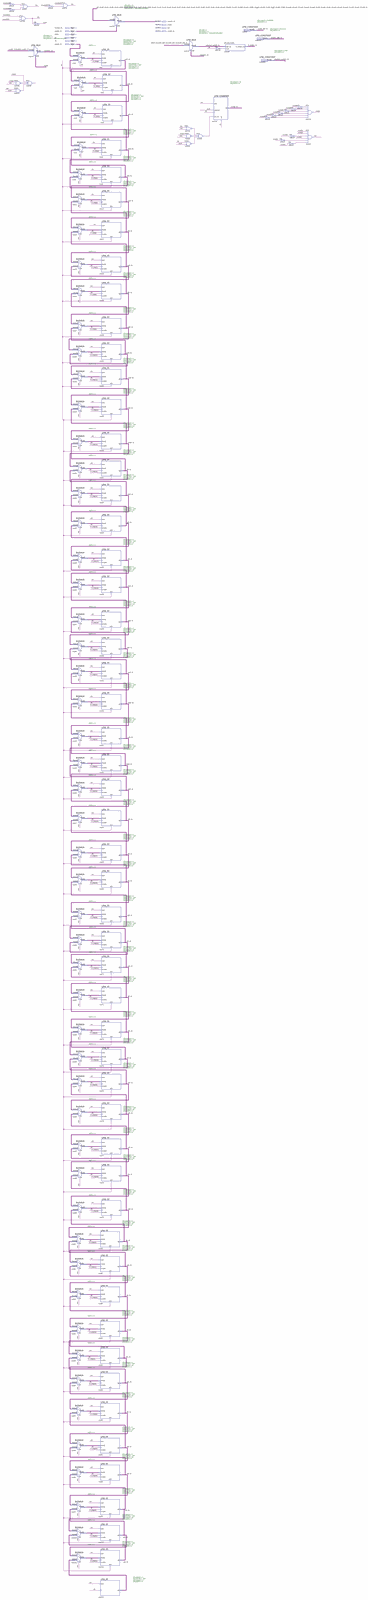
[diagram p0: schematic sheet, whole]
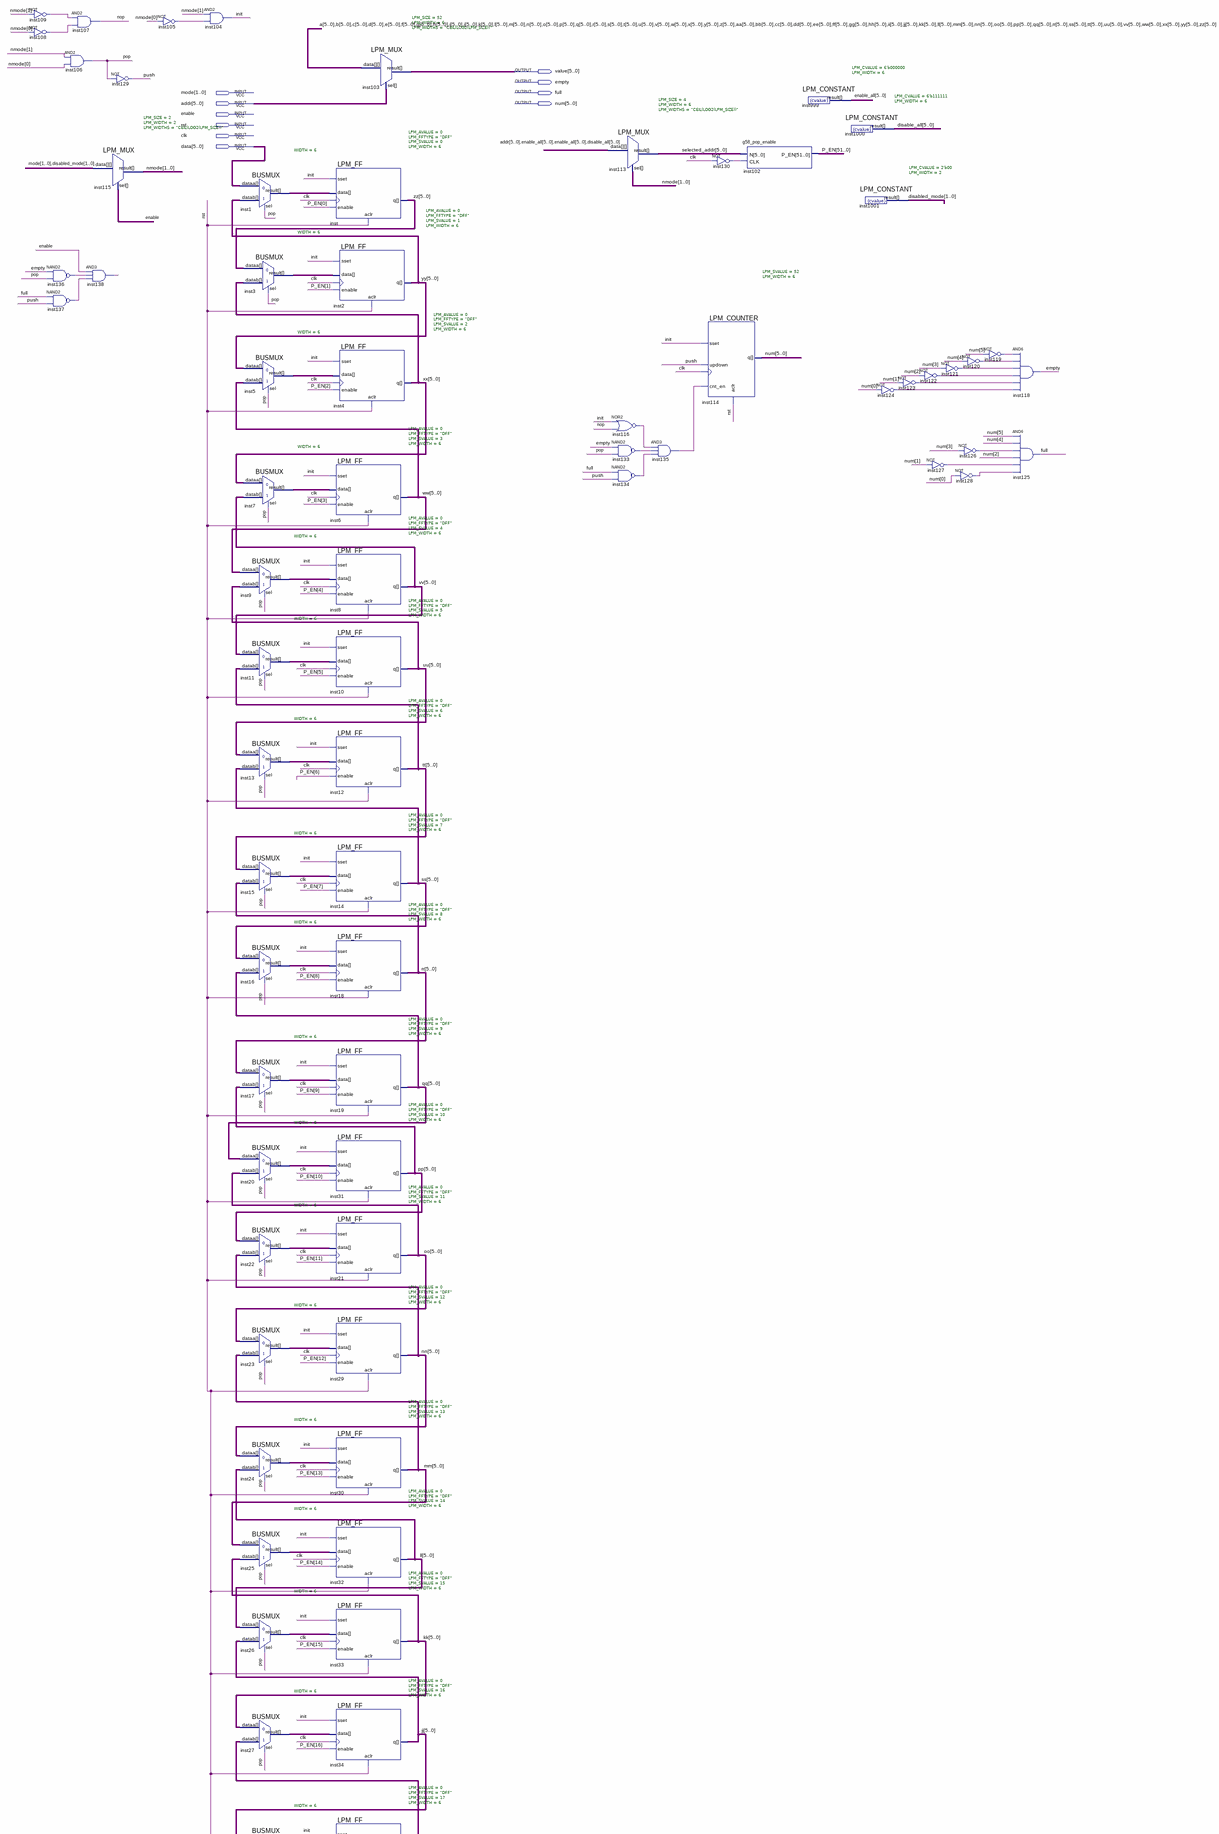
[diagram p1: schematic sheet, upper part]
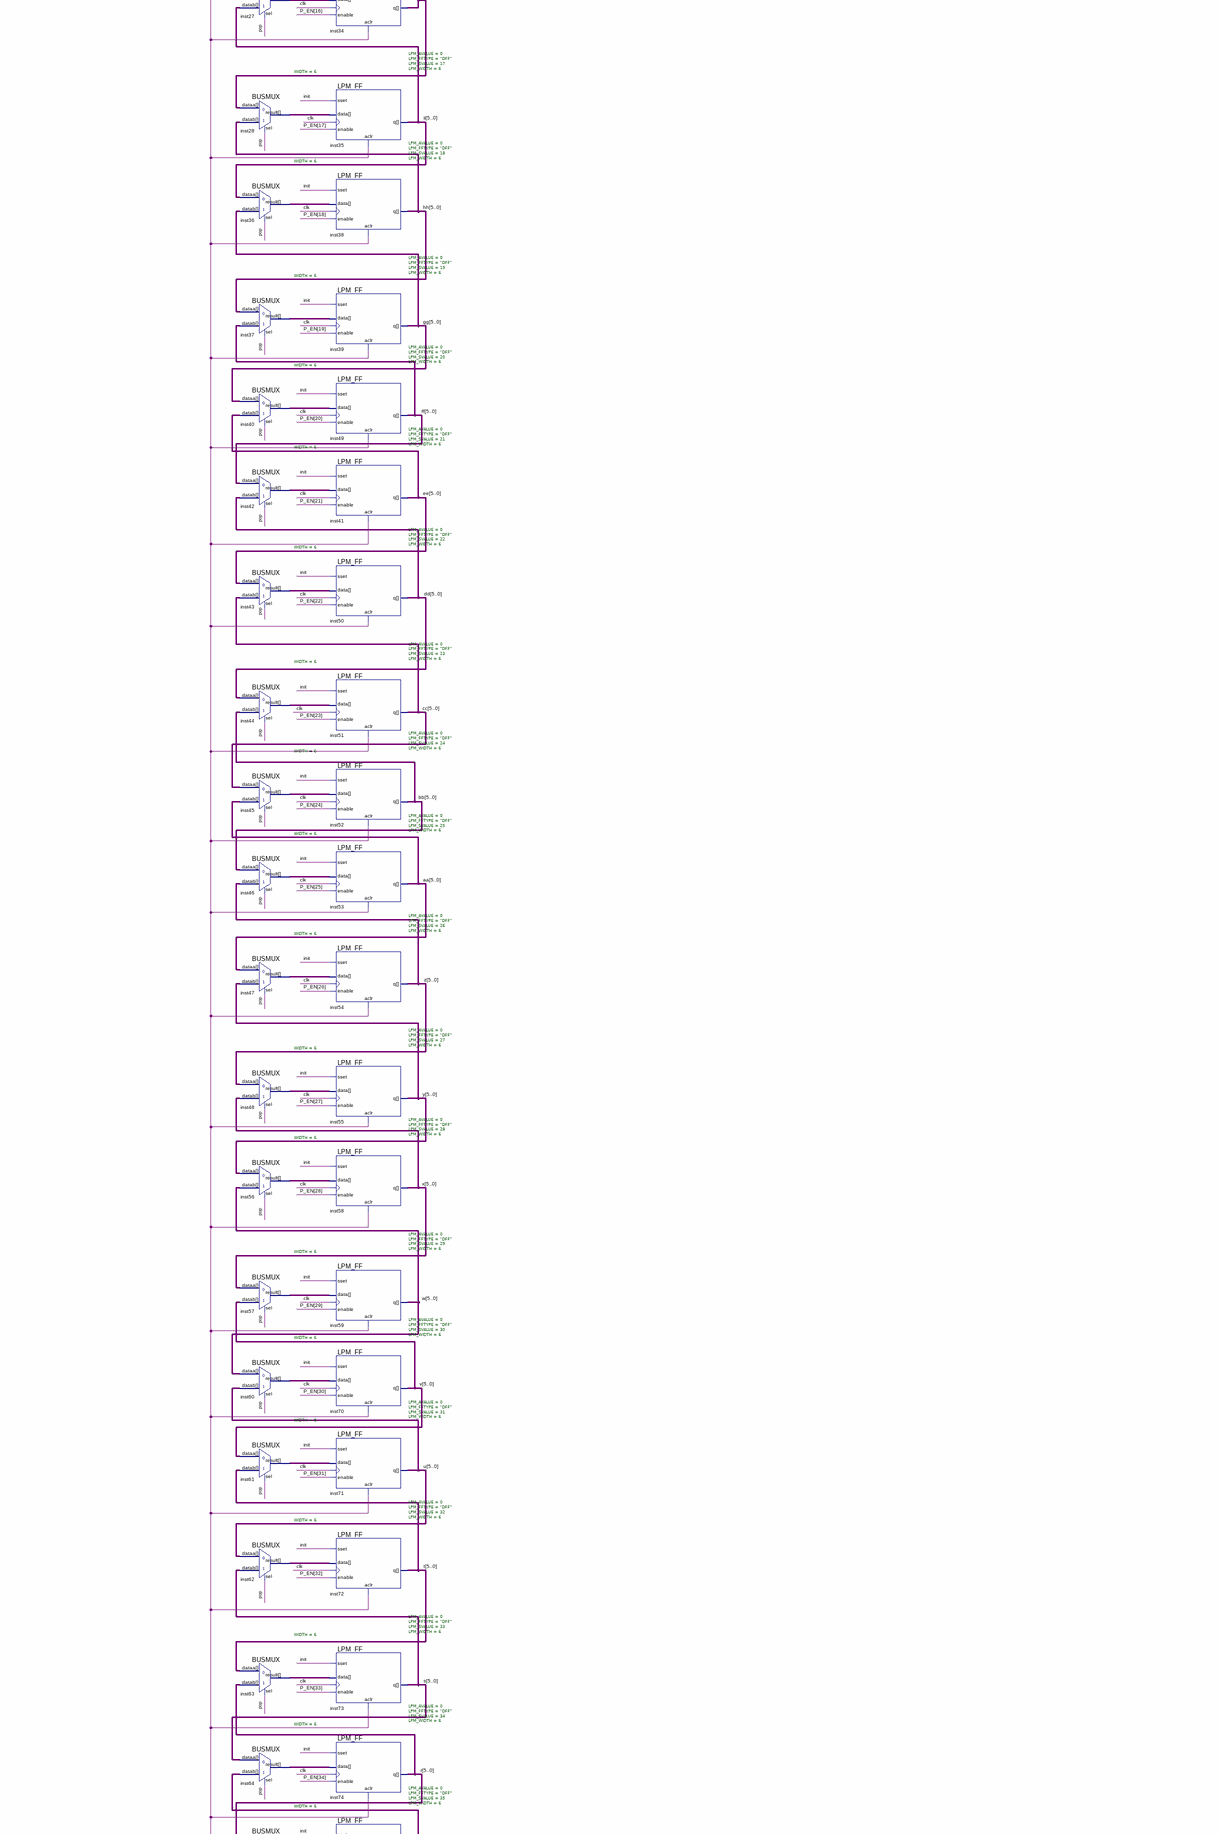
[diagram p2: schematic sheet, middle part]
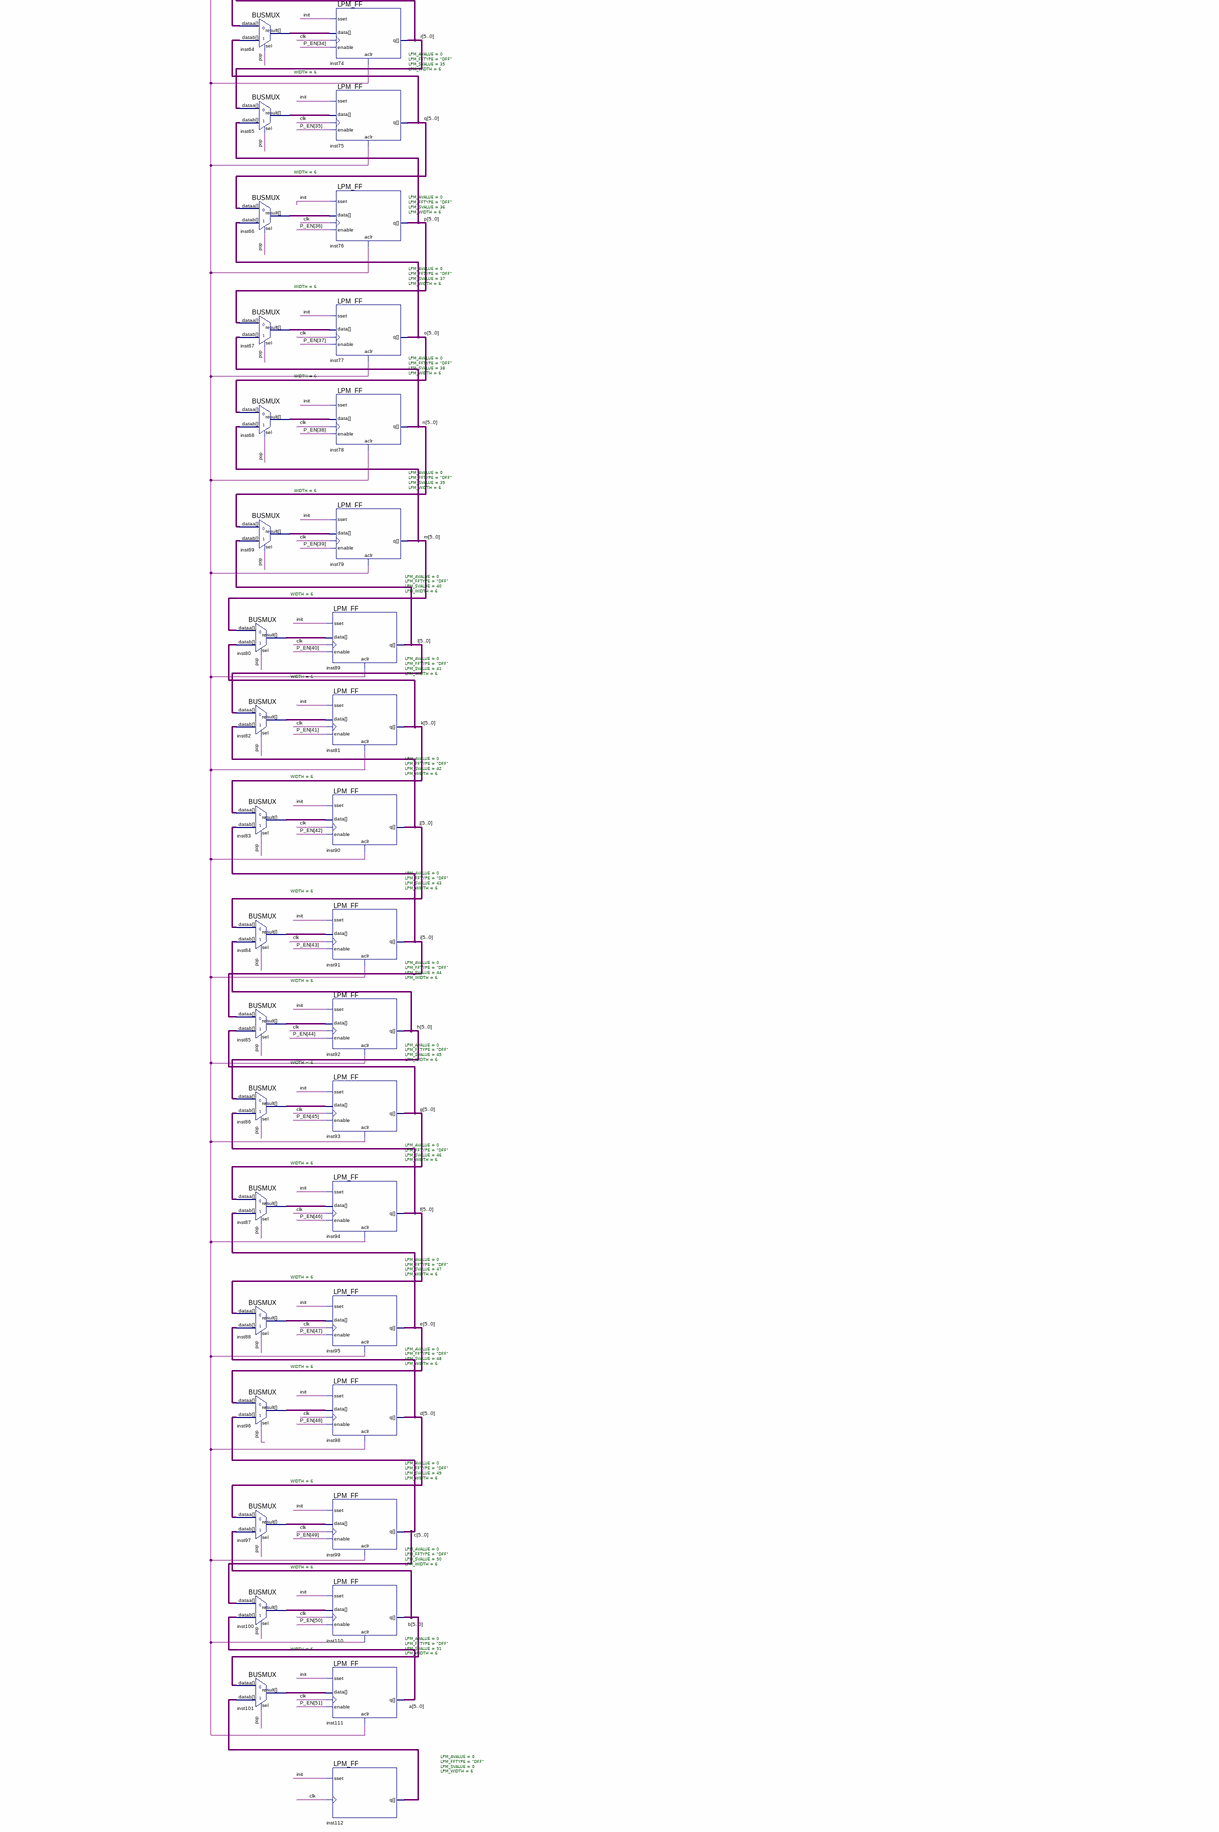
[diagram p3: schematic sheet, lower part]
// Quartus schematic g58_stack52.bdf as structural Verilog: 139 symbols, 10 pins
module g58_stack52 (
  input  [1:0] mode,
  input  [5:0] addr,
  input  enable,
  input  rst,
  input  clk,
  input  [5:0] data,
  output [5:0] value,
  output empty,
  output full,
  output [5:0] num
);

  wire init, inst105_out, inst108_out, inst109_out, inst116_out, inst119_out, inst120_out, inst121_out,
       inst122_out, inst123_out, inst124_out, inst126_out, inst127_out, inst128_out, inst130_out,
       inst133_out, inst134_out, inst135_out, inst136_out, inst137_out, inst138_out, nop, pop, push;
  wire [1:0] disabled_mode, nmode;
  wire [5:0] a, aa, b, bb, c, cc, d, dd, disable_all, e, ee, enable_all, f, ff, g, gg, h, hh, i, ii,
       inst1_result, inst3_result, inst5_result, inst7_result, inst9_result, inst11_result, inst13_result,
       inst15_result, inst16_result, inst17_result, inst20_result, inst22_result, inst23_result,
       inst24_result, inst25_result, inst26_result, inst27_result, inst28_result, inst36_result,
       inst37_result, inst40_result, inst42_result, inst43_result, inst44_result, inst45_result,
       inst46_result, inst47_result, inst48_result, inst56_result, inst57_result, inst60_result,
       inst61_result, inst62_result, inst63_result, inst64_result, inst65_result, inst66_result,
       inst67_result, inst68_result, inst69_result, inst80_result, inst82_result, inst83_result,
       inst84_result, inst85_result, inst86_result, inst87_result, inst88_result, inst96_result,
       inst97_result, inst100_result, inst101_result, inst112_q, j, jj, k, kk, l, ll, m, mm, n, nn, o, oo, p,
       pp, q, qq, r, rr, s, selected_addr, ss, t, tt, u, uu, v, vv, w, ww, x, xx, y, yy, z, zz;
  wire [51:0] P_EN;

  not inst109 (inst109_out, nmode[1]);
  not inst108 (inst108_out, nmode[0]);
  and inst106 (pop, nmode[1], nmode[0]);
  nand inst136 (inst136_out, empty, pop);
  nand inst137 (inst137_out, full, push);
  and inst107 (nop, inst109_out, inst108_out);
  LPM_MUX #(.LPM_SIZE(2), .LPM_WIDTH(2), .LPM_WIDTHS("CEIL(LOG2(LPM_SIZE))")) inst115 (
    .data({mode, disabled_mode}), .sel(enable), .result(nmode));
  and inst138 (inst138_out, enable, inst136_out, inst137_out);
  not inst129 (push, pop);
  not inst105 (inst105_out, nmode[0]);
  and inst104 (init, nmode[1], inst105_out);
  BUSMUX #(.WIDTH(6)) inst1 (.datab(yy), .sel(pop), .dataa(data), .result(inst1_result));
  BUSMUX #(.WIDTH(6)) inst9 (.datab(uu), .sel(pop), .dataa(ww), .result(inst9_result));
  BUSMUX #(.WIDTH(6)) inst11 (.datab(tt), .sel(pop), .dataa(vv), .result(inst11_result));
  BUSMUX #(.WIDTH(6)) inst13 (.datab(ss), .sel(pop), .dataa(uu), .result(inst13_result));
  BUSMUX #(.WIDTH(6)) inst15 (.datab(rr), .sel(pop), .dataa(tt), .result(inst15_result));
  BUSMUX #(.WIDTH(6)) inst16 (.datab(qq), .sel(pop), .dataa(ss), .result(inst16_result));
  BUSMUX #(.WIDTH(6)) inst17 (.datab(pp), .sel(pop), .dataa(rr), .result(inst17_result));
  BUSMUX #(.WIDTH(6)) inst20 (.datab(oo), .sel(pop), .dataa(qq), .result(inst20_result));
  BUSMUX #(.WIDTH(6)) inst22 (.datab(nn), .sel(pop), .dataa(pp), .result(inst22_result));
  BUSMUX #(.WIDTH(6)) inst23 (.datab(mm), .sel(pop), .dataa(oo), .result(inst23_result));
  BUSMUX #(.WIDTH(6)) inst24 (.datab(ll), .sel(pop), .dataa(nn), .result(inst24_result));
  BUSMUX #(.WIDTH(6)) inst25 (.datab(kk), .sel(pop), .dataa(mm), .result(inst25_result));
  BUSMUX #(.WIDTH(6)) inst26 (.datab(jj), .sel(pop), .dataa(ll), .result(inst26_result));
  BUSMUX #(.WIDTH(6)) inst27 (.datab(ii), .sel(pop), .dataa(kk), .result(inst27_result));
  BUSMUX #(.WIDTH(6)) inst28 (.datab(hh), .sel(pop), .dataa(jj), .result(inst28_result));
  BUSMUX #(.WIDTH(6)) inst36 (.datab(gg), .sel(pop), .dataa(ii), .result(inst36_result));
  BUSMUX #(.WIDTH(6)) inst37 (.datab(ff), .sel(pop), .dataa(hh), .result(inst37_result));
  BUSMUX #(.WIDTH(6)) inst40 (.datab(ee), .sel(pop), .dataa(gg), .result(inst40_result));
  BUSMUX #(.WIDTH(6)) inst42 (.datab(dd), .sel(pop), .dataa(ff), .result(inst42_result));
  BUSMUX #(.WIDTH(6)) inst43 (.datab(cc), .sel(pop), .dataa(ee), .result(inst43_result));
  BUSMUX #(.WIDTH(6)) inst44 (.datab(bb), .sel(pop), .dataa(dd), .result(inst44_result));
  BUSMUX #(.WIDTH(6)) inst45 (.datab(aa), .sel(pop), .dataa(cc), .result(inst45_result));
  BUSMUX #(.WIDTH(6)) inst46 (.datab(z), .sel(pop), .dataa(bb), .result(inst46_result));
  BUSMUX #(.WIDTH(6)) inst47 (.datab(y), .sel(pop), .dataa(aa), .result(inst47_result));
  BUSMUX #(.WIDTH(6)) inst48 (.datab(x), .sel(pop), .dataa(z), .result(inst48_result));
  BUSMUX #(.WIDTH(6)) inst56 (.datab(w), .sel(pop), .dataa(y), .result(inst56_result));
  BUSMUX #(.WIDTH(6)) inst57 (.datab(v), .sel(pop), .dataa(x), .result(inst57_result));
  BUSMUX #(.WIDTH(6)) inst60 (.datab(u), .sel(pop), .dataa(w), .result(inst60_result));
  BUSMUX #(.WIDTH(6)) inst61 (.datab(t), .sel(pop), .dataa(v), .result(inst61_result));
  BUSMUX #(.WIDTH(6)) inst62 (.datab(s), .sel(pop), .dataa(u), .result(inst62_result));
  BUSMUX #(.WIDTH(6)) inst63 (.datab(r), .sel(pop), .dataa(t), .result(inst63_result));
  BUSMUX #(.WIDTH(6)) inst64 (.datab(q), .sel(pop), .dataa(s), .result(inst64_result));
  BUSMUX #(.WIDTH(6)) inst65 (.datab(p), .sel(pop), .dataa(r), .result(inst65_result));
  BUSMUX #(.WIDTH(6)) inst66 (.datab(o), .sel(pop), .dataa(q), .result(inst66_result));
  BUSMUX #(.WIDTH(6)) inst67 (.datab(n), .sel(pop), .dataa(p), .result(inst67_result));
  BUSMUX #(.WIDTH(6)) inst68 (.datab(m), .sel(pop), .dataa(o), .result(inst68_result));
  BUSMUX #(.WIDTH(6)) inst69 (.datab(l), .sel(pop), .dataa(n), .result(inst69_result));
  BUSMUX #(.WIDTH(6)) inst80 (.datab(k), .sel(pop), .dataa(m), .result(inst80_result));
  BUSMUX #(.WIDTH(6)) inst82 (.datab(j), .sel(pop), .dataa(l), .result(inst82_result));
  BUSMUX #(.WIDTH(6)) inst83 (.datab(i), .sel(pop), .dataa(k), .result(inst83_result));
  BUSMUX #(.WIDTH(6)) inst84 (.datab(h), .sel(pop), .dataa(j), .result(inst84_result));
  BUSMUX #(.WIDTH(6)) inst85 (.datab(g), .sel(pop), .dataa(i), .result(inst85_result));
  BUSMUX #(.WIDTH(6)) inst86 (.datab(f), .sel(pop), .dataa(h), .result(inst86_result));
  BUSMUX #(.WIDTH(6)) inst87 (.datab(e), .sel(pop), .dataa(g), .result(inst87_result));
  BUSMUX #(.WIDTH(6)) inst88 (.datab(d), .sel(pop), .dataa(f), .result(inst88_result));
  BUSMUX #(.WIDTH(6)) inst96 (.datab(c), .sel(pop), .dataa(e), .result(inst96_result));
  BUSMUX #(.WIDTH(6)) inst97 (.datab(b), .sel(pop), .dataa(d), .result(inst97_result));
  BUSMUX #(.WIDTH(6)) inst100 (.datab(a), .sel(pop), .dataa(c), .result(inst100_result));
  BUSMUX #(.WIDTH(6)) inst101 (.datab(inst112_q), .sel(pop), .dataa(b), .result(inst101_result));
  BUSMUX #(.WIDTH(6)) inst3 (.datab(xx), .sel(pop), .dataa(zz), .result(inst3_result));
  BUSMUX #(.WIDTH(6)) inst5 (.datab(ww), .sel(pop), .dataa(yy), .result(inst5_result));
  BUSMUX #(.WIDTH(6)) inst7 (.datab(vv), .sel(pop), .dataa(xx), .result(inst7_result));
  LPM_FF #(.LPM_AVALUE(0), .LPM_FFTYPE("DFF"), .LPM_SVALUE(40), .LPM_WIDTH(6)) inst89 (
    .aclr(rst), .clock(clk), .data(inst80_result), .enable(P_EN[40]), .sset(init), .q(l));
  LPM_FF #(.LPM_AVALUE(0), .LPM_FFTYPE("DFF"), .LPM_SVALUE(41), .LPM_WIDTH(6)) inst81 (
    .aclr(rst), .clock(clk), .data(inst82_result), .enable(P_EN[41]), .sset(init), .q(k));
  LPM_FF #(.LPM_AVALUE(0), .LPM_FFTYPE("DFF"), .LPM_SVALUE(42), .LPM_WIDTH(6)) inst90 (
    .aclr(rst), .clock(clk), .data(inst83_result), .enable(P_EN[42]), .sset(init), .q(j));
  LPM_FF #(.LPM_AVALUE(0), .LPM_FFTYPE("DFF"), .LPM_SVALUE(43), .LPM_WIDTH(6)) inst91 (
    .aclr(rst), .clock(clk), .data(inst84_result), .enable(P_EN[43]), .sset(init), .q(i));
  LPM_FF #(.LPM_AVALUE(0), .LPM_FFTYPE("DFF"), .LPM_SVALUE(44), .LPM_WIDTH(6)) inst92 (
    .aclr(rst), .clock(clk), .data(inst85_result), .enable(P_EN[44]), .sset(init), .q(h));
  LPM_FF #(.LPM_AVALUE(0), .LPM_FFTYPE("DFF"), .LPM_SVALUE(45), .LPM_WIDTH(6)) inst93 (
    .aclr(rst), .clock(clk), .data(inst86_result), .enable(P_EN[45]), .sset(init), .q(g));
  LPM_FF #(.LPM_AVALUE(0), .LPM_FFTYPE("DFF"), .LPM_SVALUE(46), .LPM_WIDTH(6)) inst94 (
    .aclr(rst), .clock(clk), .data(inst87_result), .enable(P_EN[46]), .sset(init), .q(f));
  LPM_FF #(.LPM_AVALUE(0), .LPM_FFTYPE("DFF"), .LPM_SVALUE(47), .LPM_WIDTH(6)) inst95 (
    .aclr(rst), .clock(clk), .data(inst88_result), .enable(P_EN[47]), .sset(init), .q(e));
  LPM_FF #(.LPM_AVALUE(0), .LPM_FFTYPE("DFF"), .LPM_SVALUE(48), .LPM_WIDTH(6)) inst98 (
    .aclr(rst), .clock(clk), .data(inst96_result), .enable(P_EN[48]), .sset(init), .q(d));
  LPM_FF #(.LPM_AVALUE(0), .LPM_FFTYPE("DFF"), .LPM_SVALUE(49), .LPM_WIDTH(6)) inst99 (
    .aclr(rst), .clock(clk), .data(inst97_result), .enable(P_EN[49]), .sset(init), .q(c));
  LPM_FF #(.LPM_AVALUE(0), .LPM_FFTYPE("DFF"), .LPM_SVALUE(50), .LPM_WIDTH(6)) inst110 (
    .aclr(rst), .clock(clk), .data(inst100_result), .enable(P_EN[50]), .sset(init), .q(b));
  LPM_FF #(.LPM_AVALUE(0), .LPM_FFTYPE("DFF"), .LPM_SVALUE(51), .LPM_WIDTH(6)) inst111 (
    .aclr(rst), .clock(clk), .data(inst101_result), .enable(P_EN[51]), .sset(init), .q(a));
  LPM_FF #(.LPM_AVALUE(0), .LPM_FFTYPE("DFF"), .LPM_SVALUE(0), .LPM_WIDTH(6)) inst112 (
    .clock(clk), .sset(init), .q(inst112_q));
  LPM_FF #(.LPM_AVALUE(0), .LPM_FFTYPE("DFF"), .LPM_SVALUE(0), .LPM_WIDTH(6)) inst (
    .aclr(rst), .clock(clk), .data(inst1_result), .enable(P_EN[0]), .sset(init), .q(zz));
  LPM_FF #(.LPM_AVALUE(0), .LPM_FFTYPE("DFF"), .LPM_SVALUE(1), .LPM_WIDTH(6)) inst2 (
    .aclr(rst), .clock(clk), .data(inst3_result), .enable(P_EN[1]), .sset(init), .q(yy));
  LPM_FF #(.LPM_AVALUE(0), .LPM_FFTYPE("DFF"), .LPM_SVALUE(2), .LPM_WIDTH(6)) inst4 (
    .aclr(rst), .clock(clk), .data(inst5_result), .enable(P_EN[2]), .sset(init), .q(xx));
  LPM_FF #(.LPM_AVALUE(0), .LPM_FFTYPE("DFF"), .LPM_SVALUE(3), .LPM_WIDTH(6)) inst6 (
    .aclr(rst), .clock(clk), .data(inst7_result), .enable(P_EN[3]), .sset(init), .q(ww));
  LPM_FF #(.LPM_AVALUE(0), .LPM_FFTYPE("DFF"), .LPM_SVALUE(4), .LPM_WIDTH(6)) inst8 (
    .aclr(rst), .clock(clk), .data(inst9_result), .enable(P_EN[4]), .sset(init), .q(vv));
  LPM_FF #(.LPM_AVALUE(0), .LPM_FFTYPE("DFF"), .LPM_SVALUE(5), .LPM_WIDTH(6)) inst10 (
    .aclr(rst), .clock(clk), .data(inst11_result), .enable(P_EN[5]), .sset(init), .q(uu));
  LPM_FF #(.LPM_AVALUE(0), .LPM_FFTYPE("DFF"), .LPM_SVALUE(6), .LPM_WIDTH(6)) inst12 (
    .aclr(rst), .clock(clk), .data(inst13_result), .enable(P_EN[6]), .sset(init), .q(tt));
  LPM_FF #(.LPM_AVALUE(0), .LPM_FFTYPE("DFF"), .LPM_SVALUE(7), .LPM_WIDTH(6)) inst14 (
    .aclr(rst), .clock(clk), .data(inst15_result), .enable(P_EN[7]), .sset(init), .q(ss));
  LPM_FF #(.LPM_AVALUE(0), .LPM_FFTYPE("DFF"), .LPM_SVALUE(8), .LPM_WIDTH(6)) inst18 (
    .aclr(rst), .clock(clk), .data(inst16_result), .enable(P_EN[8]), .sset(init), .q(rr));
  LPM_FF #(.LPM_AVALUE(0), .LPM_FFTYPE("DFF"), .LPM_SVALUE(9), .LPM_WIDTH(6)) inst19 (
    .aclr(rst), .clock(clk), .data(inst17_result), .enable(P_EN[9]), .sset(init), .q(qq));
  LPM_FF #(.LPM_AVALUE(0), .LPM_FFTYPE("DFF"), .LPM_SVALUE(10), .LPM_WIDTH(6)) inst31 (
    .aclr(rst), .clock(clk), .data(inst20_result), .enable(P_EN[10]), .sset(init), .q(pp));
  LPM_FF #(.LPM_AVALUE(0), .LPM_FFTYPE("DFF"), .LPM_SVALUE(11), .LPM_WIDTH(6)) inst21 (
    .aclr(rst), .clock(clk), .data(inst22_result), .enable(P_EN[11]), .sset(init), .q(oo));
  LPM_FF #(.LPM_AVALUE(0), .LPM_FFTYPE("DFF"), .LPM_SVALUE(12), .LPM_WIDTH(6)) inst29 (
    .aclr(rst), .clock(clk), .data(inst23_result), .enable(P_EN[12]), .sset(init), .q(nn));
  LPM_FF #(.LPM_AVALUE(0), .LPM_FFTYPE("DFF"), .LPM_SVALUE(13), .LPM_WIDTH(6)) inst30 (
    .aclr(rst), .clock(clk), .data(inst24_result), .enable(P_EN[13]), .sset(init), .q(mm));
  LPM_FF #(.LPM_AVALUE(0), .LPM_FFTYPE("DFF"), .LPM_SVALUE(14), .LPM_WIDTH(6)) inst32 (
    .aclr(rst), .clock(clk), .data(inst25_result), .enable(P_EN[14]), .sset(init), .q(ll));
  LPM_FF #(.LPM_AVALUE(0), .LPM_FFTYPE("DFF"), .LPM_SVALUE(15), .LPM_WIDTH(6)) inst33 (
    .aclr(rst), .clock(clk), .data(inst26_result), .enable(P_EN[15]), .sset(init), .q(kk));
  LPM_FF #(.LPM_AVALUE(0), .LPM_FFTYPE("DFF"), .LPM_SVALUE(16), .LPM_WIDTH(6)) inst34 (
    .aclr(rst), .clock(clk), .data(inst27_result), .enable(P_EN[16]), .sset(init), .q(jj));
  LPM_FF #(.LPM_AVALUE(0), .LPM_FFTYPE("DFF"), .LPM_SVALUE(17), .LPM_WIDTH(6)) inst35 (
    .aclr(rst), .clock(clk), .data(inst28_result), .enable(P_EN[17]), .sset(init), .q(ii));
  LPM_FF #(.LPM_AVALUE(0), .LPM_FFTYPE("DFF"), .LPM_SVALUE(18), .LPM_WIDTH(6)) inst38 (
    .aclr(rst), .clock(clk), .data(inst36_result), .enable(P_EN[18]), .sset(init), .q(hh));
  LPM_FF #(.LPM_AVALUE(0), .LPM_FFTYPE("DFF"), .LPM_SVALUE(19), .LPM_WIDTH(6)) inst39 (
    .aclr(rst), .clock(clk), .data(inst37_result), .enable(P_EN[19]), .sset(init), .q(gg));
  LPM_FF #(.LPM_AVALUE(0), .LPM_FFTYPE("DFF"), .LPM_SVALUE(20), .LPM_WIDTH(6)) inst49 (
    .aclr(rst), .clock(clk), .data(inst40_result), .enable(P_EN[20]), .sset(init), .q(ff));
  LPM_FF #(.LPM_AVALUE(0), .LPM_FFTYPE("DFF"), .LPM_SVALUE(21), .LPM_WIDTH(6)) inst41 (
    .aclr(rst), .clock(clk), .data(inst42_result), .enable(P_EN[21]), .sset(init), .q(ee));
  LPM_FF #(.LPM_AVALUE(0), .LPM_FFTYPE("DFF"), .LPM_SVALUE(22), .LPM_WIDTH(6)) inst50 (
    .aclr(rst), .clock(clk), .data(inst43_result), .enable(P_EN[22]), .sset(init), .q(dd));
  LPM_FF #(.LPM_AVALUE(0), .LPM_FFTYPE("DFF"), .LPM_SVALUE(23), .LPM_WIDTH(6)) inst51 (
    .aclr(rst), .clock(clk), .data(inst44_result), .enable(P_EN[23]), .sset(init), .q(cc));
  LPM_FF #(.LPM_AVALUE(0), .LPM_FFTYPE("DFF"), .LPM_SVALUE(24), .LPM_WIDTH(6)) inst52 (
    .aclr(rst), .clock(clk), .data(inst45_result), .enable(P_EN[24]), .sset(init), .q(bb));
  LPM_FF #(.LPM_AVALUE(0), .LPM_FFTYPE("DFF"), .LPM_SVALUE(25), .LPM_WIDTH(6)) inst53 (
    .aclr(rst), .clock(clk), .data(inst46_result), .enable(P_EN[25]), .sset(init), .q(aa));
  LPM_FF #(.LPM_AVALUE(0), .LPM_FFTYPE("DFF"), .LPM_SVALUE(26), .LPM_WIDTH(6)) inst54 (
    .aclr(rst), .clock(clk), .data(inst47_result), .enable(P_EN[26]), .sset(init), .q(z));
  LPM_FF #(.LPM_AVALUE(0), .LPM_FFTYPE("DFF"), .LPM_SVALUE(27), .LPM_WIDTH(6)) inst55 (
    .aclr(rst), .clock(clk), .data(inst48_result), .enable(P_EN[27]), .sset(init), .q(y));
  LPM_FF #(.LPM_AVALUE(0), .LPM_FFTYPE("DFF"), .LPM_SVALUE(28), .LPM_WIDTH(6)) inst58 (
    .aclr(rst), .clock(clk), .data(inst56_result), .enable(P_EN[28]), .sset(init), .q(x));
  LPM_FF #(.LPM_AVALUE(0), .LPM_FFTYPE("DFF"), .LPM_SVALUE(29), .LPM_WIDTH(6)) inst59 (
    .aclr(rst), .clock(clk), .data(inst57_result), .enable(P_EN[29]), .sset(init), .q(w));
  LPM_FF #(.LPM_AVALUE(0), .LPM_FFTYPE("DFF"), .LPM_SVALUE(30), .LPM_WIDTH(6)) inst70 (
    .aclr(rst), .clock(clk), .data(inst60_result), .enable(P_EN[30]), .sset(init), .q(v));
  LPM_FF #(.LPM_AVALUE(0), .LPM_FFTYPE("DFF"), .LPM_SVALUE(31), .LPM_WIDTH(6)) inst71 (
    .aclr(rst), .clock(clk), .data(inst61_result), .enable(P_EN[31]), .sset(init), .q(u));
  LPM_FF #(.LPM_AVALUE(0), .LPM_FFTYPE("DFF"), .LPM_SVALUE(32), .LPM_WIDTH(6)) inst72 (
    .aclr(rst), .clock(clk), .data(inst62_result), .enable(P_EN[32]), .sset(init), .q(t));
  LPM_FF #(.LPM_AVALUE(0), .LPM_FFTYPE("DFF"), .LPM_SVALUE(33), .LPM_WIDTH(6)) inst73 (
    .aclr(rst), .clock(clk), .data(inst63_result), .enable(P_EN[33]), .sset(init), .q(s));
  LPM_FF #(.LPM_AVALUE(0), .LPM_FFTYPE("DFF"), .LPM_SVALUE(34), .LPM_WIDTH(6)) inst74 (
    .aclr(rst), .clock(clk), .data(inst64_result), .enable(P_EN[34]), .sset(init), .q(r));
  LPM_FF #(.LPM_AVALUE(0), .LPM_FFTYPE("DFF"), .LPM_SVALUE(35), .LPM_WIDTH(6)) inst75 (
    .aclr(rst), .clock(clk), .data(inst65_result), .enable(P_EN[35]), .sset(init), .q(q));
  LPM_FF #(.LPM_AVALUE(0), .LPM_FFTYPE("DFF"), .LPM_SVALUE(36), .LPM_WIDTH(6)) inst76 (
    .aclr(rst), .clock(clk), .data(inst66_result), .enable(P_EN[36]), .sset(init), .q(p));
  LPM_FF #(.LPM_AVALUE(0), .LPM_FFTYPE("DFF"), .LPM_SVALUE(37), .LPM_WIDTH(6)) inst77 (
    .aclr(rst), .clock(clk), .data(inst67_result), .enable(P_EN[37]), .sset(init), .q(o));
  LPM_FF #(.LPM_AVALUE(0), .LPM_FFTYPE("DFF"), .LPM_SVALUE(38), .LPM_WIDTH(6)) inst78 (
    .aclr(rst), .clock(clk), .data(inst68_result), .enable(P_EN[38]), .sset(init), .q(n));
  LPM_FF #(.LPM_AVALUE(0), .LPM_FFTYPE("DFF"), .LPM_SVALUE(39), .LPM_WIDTH(6)) inst79 (
    .aclr(rst), .clock(clk), .data(inst69_result), .enable(P_EN[39]), .sset(init), .q(m));
  LPM_MUX #(.LPM_SIZE(52), .LPM_WIDTH(6), .LPM_WIDTHS("CEIL(LOG2(LPM_SIZE))")) inst103 (
    .data({a, b, c, d, e, f, g, h, i, j, k, l, m, n, o, p, q, r, s, t, u, v, w, x, y, z, aa, bb, cc, dd, ee, ff, gg, hh, ii, jj, kk, ll, mm, nn, oo, pp, qq, rr, ss, tt, uu, vv, ww, xx, yy, zz}),
    .sel(addr), .result(value));
  LPM_MUX #(.LPM_SIZE(4), .LPM_WIDTH(6), .LPM_WIDTHS("CEIL(LOG2(LPM_SIZE))")) inst113 (
    .data({addr, enable_all, enable_all, disable_all}), .sel(nmode), .result(selected_addr));
  nor inst116 (inst116_out, init, nop);
  nand inst133 (inst133_out, empty, pop);
  nand inst134 (inst134_out, full, push);
  and inst135 (inst135_out, inst116_out, inst133_out, inst134_out);
  not inst130 (inst130_out, clk);
  LPM_COUNTER #(.LPM_SVALUE(52), .LPM_WIDTH(6)) inst114 (
    .aclr(rst), .clock(clk), .cnt_en(inst135_out), .sset(init), .updown(push), .q(num));
  g58_pop_enable inst102 (.N(selected_addr), .CLK(inst130_out), .P_EN(P_EN));
  LPM_CONSTANT #(.LPM_CVALUE(6'b000000), .LPM_WIDTH(6)) inst999 (.result(enable_all));
  LPM_CONSTANT #(.LPM_CVALUE(6'b111111), .LPM_WIDTH(6)) inst1000 (.result(disable_all));
  LPM_CONSTANT #(.LPM_CVALUE(2'b00), .LPM_WIDTH(2)) inst1001 (.result(disabled_mode));
  not inst123 (inst123_out, num[1]);
  not inst124 (inst124_out, num[0]);
  not inst122 (inst122_out, num[2]);
  not inst127 (inst127_out, num[1]);
  not inst121 (inst121_out, num[3]);
  not inst128 (inst128_out, num[0]);
  not inst119 (inst119_out, num[5]);
  not inst120 (inst120_out, num[4]);
  not inst126 (inst126_out, num[3]);
  and inst118 (empty, inst119_out, inst120_out, inst121_out, inst122_out, inst123_out, inst124_out);
  and inst125 (full, num[5], num[4], inst126_out, num[2], inst127_out, inst128_out);
endmodule
